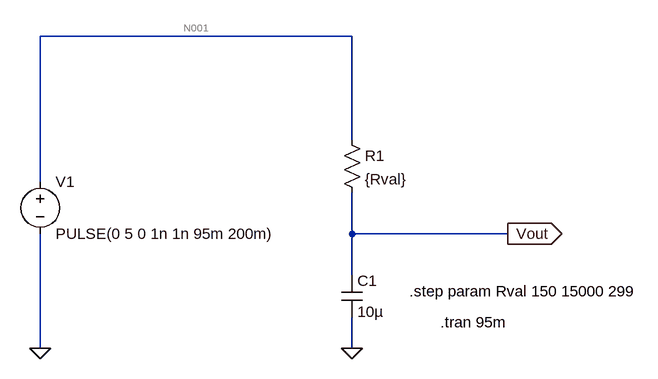
[diagram p0: schematic rc_drift_sweep.asc]
rc_drift_sweep.asc, the LTspice schematic file:
Version 4.1
SHEET 1 880 680
WIRE -512 -64 -992 -64
WIRE -512 96 -512 -64
WIRE -992 160 -992 -64
WIRE -512 240 -512 176
WIRE -272 240 -512 240
WIRE -512 304 -512 240
WIRE -992 416 -992 240
WIRE -512 416 -512 368
FLAG -272 240 Vout
IOPIN -272 240 Out
FLAG -992 416 0
FLAG -512 416 0
SYMBOL voltage -992 144 R0
WINDOW 123 0 0 Left 0
WINDOW 39 0 0 Left 0
SYMATTR InstName V1
SYMATTR Value PULSE(0 5 0 1n 1n 95m 200m)
SYMBOL res -528 80 R0
SYMATTR InstName R1
SYMATTR Value {Rval}
SYMBOL cap -528 304 R0
SYMATTR InstName C1
SYMATTR Value 10µ
SYMATTR SpiceLine V=6.3 Irms=0 Rser=4 Lser=0 mfg="AVX" pn="TAJA106M006" type="Tantalum"
TEXT -376 376 Left 2 !.tran 95m
TEXT -424 328 Left 2 !.step param Rval 150 15000 299

The netlist it stands for:
* rc_drift_sweep.asc
V1 N001 0 PULSE(0 5 0 1n 1n 95m 200m)
R1 N001 Vout {Rval}
C1 Vout 0 10µ V=6.3 Irms=0 Rser=4 Lser=0 mfg="AVX" pn="TAJA106M006" type="Tantalum"
.tran 95m
.step param Rval 150 15000 299
.backanno
.end

* Results of the author's LTspice run, read from the files saved beside the schematic
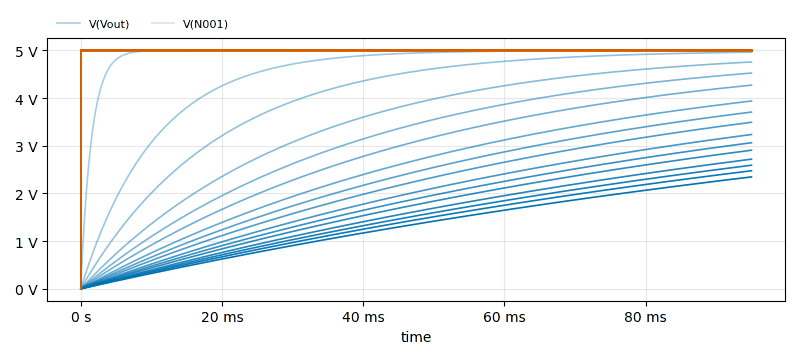
[diagram p1: Transient Analysis of rc_drift_sweep.asc, plotted from the saved traces]
* Transient Analysis, 51 runs:
*   V(Vout) [run 1]: min 0 V, max 5 V, average 4.921 V, rms 4.94 V, last 5 V
*   V(Vout) [run 2]: min 0 V, max 4.999 V, average 4.449 V, rms 4.568 V, last 4.999 V
*   V(Vout) [run 3]: min 0 V, max 4.962 V, average 3.985 V, rms 4.171 V, last 4.962 V
*   V(Vout) [run 4]: min 0 V, max 4.757 V, average 3.428 V, rms 3.66 V, last 4.757 V
*   V(Vout) [run 5]: min 0 V, max 4.524 V, average 3.078 V, rms 3.322 V, last 4.524 V
*   V(Vout) [run 6]: min 0 V, max 4.27 V, average 2.782 V, rms 3.029 V, last 4.27 V
*   V(Vout) [run 7]: min 0 V, max 3.938 V, average 2.459 V, rms 2.7 V, last 3.938 V
*   V(Vout) [run 8]: min 0 V, max 3.706 V, average 2.259 V, rms 2.493 V, last 3.706 V
*   V(N001) [run 1]: min 0 V, max 5 V, average 5 V, rms 5 V, last 5 V
*   V(N001) [run 2]: min 0 V, max 5 V, average 5 V, rms 5 V, last 5 V
*   V(N001) [run 3]: min 0 V, max 5 V, average 5 V, rms 5 V, last 5 V
*   V(N001) [run 4]: min 0 V, max 5 V, average 5 V, rms 5 V, last 5 V
*   V(N001) [run 5]: min 0 V, max 5 V, average 5 V, rms 5 V, last 5 V
*   V(N001) [run 6]: min 0 V, max 5 V, average 5 V, rms 5 V, last 5 V
*   V(N001) [run 7]: min 0 V, max 5 V, average 5 V, rms 5 V, last 5 V
*   V(N001) [run 8]: min 0 V, max 5 V, average 5 V, rms 5 V, last 5 V